# Altium project Main Board Rev2.PrjPcb
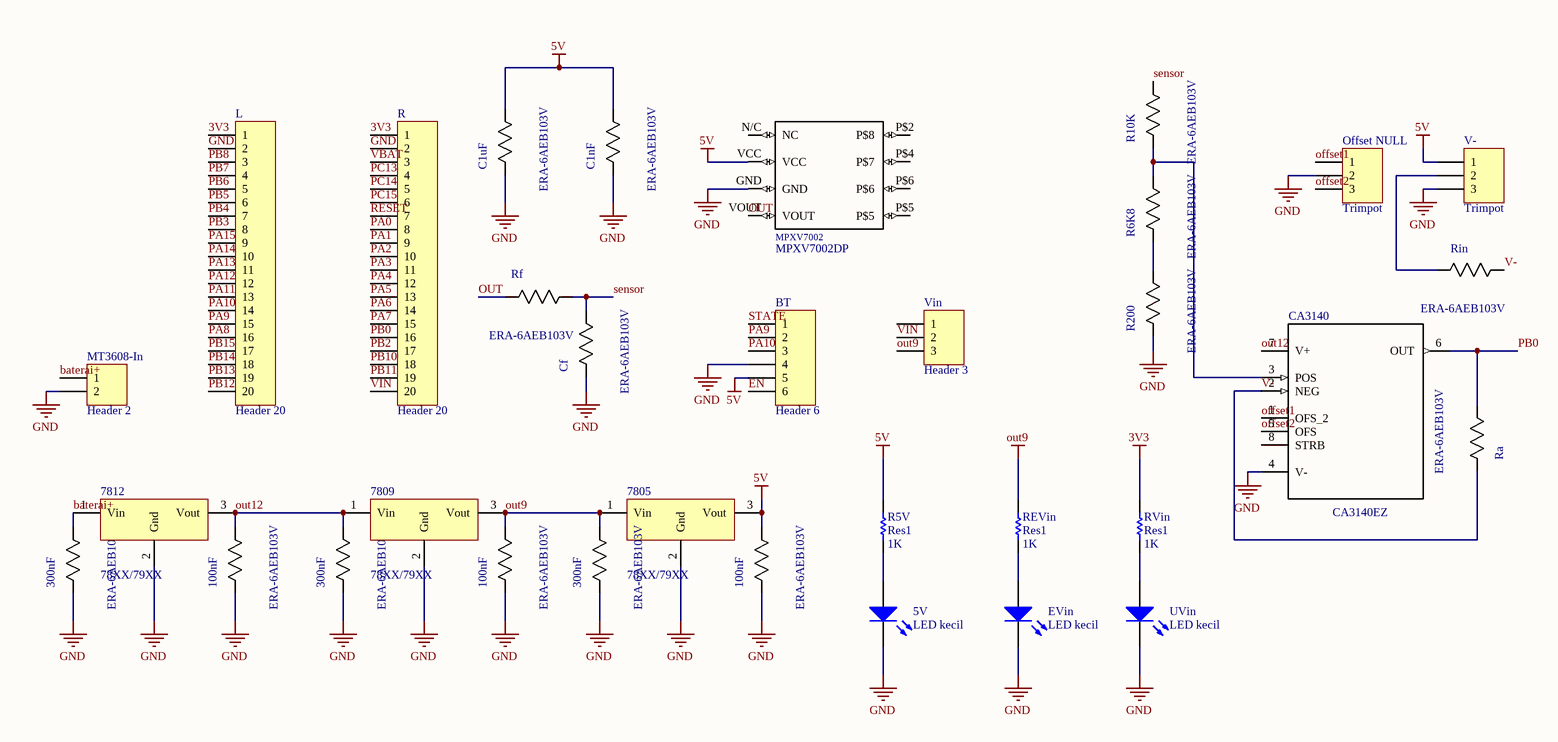
[diagram p0: Main Board Rev2.SchDoc]
1 sheet, 33 parts. Net scope: global (net labels, ports and power ports of the same name join across sheets).
Board file: Main Board Rev2_1_1.PcbDoc

## Sheet Main Board Rev2.SchDoc
size A3

### Parts
(Parts that share a designator on the sheet are numbered #1, #2 ... from top to bottom, then left to right.)
5V  LED kecil  [LED kecil]
100nF#1  ERA-6AEB103V  [RESC2013X65N]
100nF#2  ERA-6AEB103V  [RESC2013X65N]
100nF#3  ERA-6AEB103V  [RESC2013X65N]
300nF#1  ERA-6AEB103V  [RESC2013X65N]
300nF#2  ERA-6AEB103V  [RESC2013X65N]
300nF#3  ERA-6AEB103V  [RESC2013X65N]
7805  78XX/79XX  [78XX/79XX]
7809  78XX/79XX  [78XX/79XX]
7812  78XX/79XX  [78XX/79XX]
BT  Header 6  [HDR1X6]
C1nF  ERA-6AEB103V  [RESC2013X65N]
C1uF  ERA-6AEB103V  [RESC2013X65N]
CA3140  CA3140EZ  [DIP254P762X533-8]
Cf  ERA-6AEB103V  [RESC2013X65N]
EVin  LED kecil  [LED kecil]
L  Header 20  [HDR1X20]
MPXV7002DP  MPXV7002  [SOP8_MPXV7002(Primary)]  (value not drawn)
MT3608-In  Header 2  [HDR1X2]
Offset_NULL  Trimpot  [Trimpot Duduk]
R  Header 20  [HDR1X20]
R5V  Res1  value 1K  [AXIAL-0.3]
R6K8  ERA-6AEB103V  [RESC2013X65N]
R10K  ERA-6AEB103V  [RESC2013X65N]
R200  ERA-6AEB103V  [RESC2013X65N]
Ra  ERA-6AEB103V  [RESC2013X65N]
REVin  Res1  value 1K  [AXIAL-0.3]
Rf  ERA-6AEB103V  [RESC2013X65N]
Rin  ERA-6AEB103V  [RESC2013X65N]
RVin  Res1  value 1K  [AXIAL-0.3]
UVin  LED kecil  [LED kecil]
V-  Trimpot  [Trimpot Duduk]
Vin  Header 3  [HDR1X3]

### Nets
3V3: L.1 R.1 RVin.2
5V: 100nF#3.1(R1) 7805.3(Vout) BT.5 C1nF.1(R1) C1uF.1(R1) MPXV7002DP.VCC R5V.2 V-.1
GND: 5V.2(K) 100nF#1.2(R2) 100nF#2.2(R2) 100nF#3.2(R2) 300nF#1.2(R2) 300nF#2.2(R2) 300nF#3.2(R2) 7805.2(Gnd) 7809.2(Gnd) 7812.2(Gnd) BT.4 C1nF.2(R2) C1uF.2(R2) CA3140.4(V-) Cf.2(R2) EVin.2(K) L.2 MPXV7002DP.GND MT3608-In.2 Offset_NULL.2 R.2 R200.2(R2) UVin.2(K) V-.3
out9: 100nF#2.1(R1) 300nF#3.1(R1) 7805.1(Vin) 7809.3(Vout) REVin.2 Vin.3
baterai+: 300nF#1.1(R1) 7812.1(Vin) MT3608-In.1
EN: BT.6
offset1: CA3140.1(OFS_2) Offset_NULL.1
offset2: CA3140.5(OFS) Offset_NULL.3
OUT: MPXV7002DP.VOUT Rf.2(R2)
out12: 100nF#1.1(R1) 300nF#2.1(R1) 7809.1(Vin) 7812.3(Vout) CA3140.7(V+)
PA0: R.8
PA1: R.9
PA2: R.10
PA3: R.11
PA4: R.12
PA5: R.13
PA6: R.14
PA7: R.15
PA8: L.16
PA9: BT.2 L.15
PA10: BT.3 L.14
PA11: L.13
PA12: L.12
PA13: L.11
PA14: L.10
PA15: L.9
PB0: CA3140.6(OUT) R.16 Ra.2(R2)
PB2: R.17
PB3: L.8
PB4: L.7
PB5: L.6
PB6: L.5
PB7: L.4
PB8: L.3
PB10: R.18
PB11: R.19
PB12: L.20
PB13: L.19
PB14: L.18
PB15: L.17
PC13: R.4
PC14: R.5
PC15: R.6
RESET: R.7
sensor: Cf.1(R1) R10K.1(R1) Rf.1(R1)
STATE: BT.1
V-: CA3140.2(NEG) Ra.1(R1) Rin.1(R1)
VBAT: R.3
VIN: R.20 Vin.2
Net5V_1: 5V.1(A) R5V.1
NetCA3140_3: CA3140.3(POS) R6K8.1(R1) R10K.2(R2)
NetEVin_1: EVin.1(A) REVin.1
NetR6K8_2: R6K8.2(R2) R200.1(R1)
NetRin_2: Rin.2(R2) V-.2
NetRVin_1: RVin.1 UVin.1(A)

Not connected (* = marked no-connect by the designer): CA3140 8(STRB); MPXV7002DP N/C(NC) P$2(P$8) P$4(P$7) P$5 P$6; Vin 1

### Notes on the sheet
- Title
- Size:
- Date:
- A3
- Number:
- Time:
- Revision:
- Sheet
- of
- File:

### Library data of the parts
100nF#1-100nF#3 300nF#1-300nF#3 C1nF C1uF Cf R6K8 R10K R200 Ra Rf Rin = ERA-6AEB103V: Res Thin Film 0805 10K Ohm 0.1%25 0.125W%281/8W%29 %C3%98%C2%A2%C3%82%C2%B125ppm/%C3%98%C2%A2%C3%82%C2%B0C Molded SMD Automotive Punched T/R; MF: Panasonic; MP: ERA-6AEB103V; Price: 3.38 USD; Availability: Good; Package: 0805 Panasonic; Value: *
7805 7809 7812 = 7805/7809/7812/7905/7909/7912
BT = Header 6: Header, 6-Pin; LatestRevisionDate: 17-Jul-2002; LatestRevisionNote: Re-released for DXP Platform.; Publisher: Altium Limited
CA3140 = CA3140EZ: CA140 Series 4.5 MHz 9 V/us 36 V BiMOS Operational Amplifier - PDIP-8; MF: Intersil; Package: DIP-8 Intersil; Availability: Good; MP: CA3140EZ; Price: 1.65 USD; Value: *
L R = Header 20: Header, 20-Pin; LatestRevisionDate: 17-Jul-2002; LatestRevisionNote: Re-released for DXP Platform.; Publisher: Altium Limited
MPXV7002DP = MPXV7002: Pressure Sensor 0.5V to 4.5V -2kPa to 2kPa Differential 8-Pin SNSR Tray; MP: MPXV7002DP; MF: NXP Semiconductors; Price: 9.57 USD; Availability: Good; Package: - NXP Semiconductors; Value: *
MT3608-In = Header 2: Header, 2-Pin; LatestRevisionDate: 17-Jul-2002; LatestRevisionNote: Re-released for DXP Platform.; Publisher: Altium Limited
Offset_NULL V- = Trimpot Duduk
R5V REVin RVin = Res1: Resistor; Published: 8-Jun-2000; LatestRevisionDate: 17-Jul-2002; LatestRevisionNote: Re-released for DXP Platform.; PackageReference: AXIAL-0.3; Publisher: Altium Limited; PackageDescription: Axial Device, Thru-Hole; 2 Leads; 0.3 in Pin Spacing
Vin = Header 3: Header, 3-Pin; LatestRevisionDate: 17-Jul-2002; LatestRevisionNote: Re-released for DXP Platform.; Publisher: Altium Limited